# Altium schematic sheet Main.SchDoc: main
size 431 x 279 mm; VersionControl_RevNumber: 1.0; VersionControl_ProjFolderRevNumber: 1.0.0; ApprovedBy: ESE; CheckedBy: Justin, Bhagath; Author: Justin, bhagath; CompanyName: ESE Dept; DrawnBy: Justin, Bhagath; Engineer: Justin, Bhagath; Organization: ORGANIZATION; Address1: Electrical Engineering; Address2: 200 S 33rd St; Address3: Philadelphia; Address4: Pa 19104; DocumentNumber: 1; Revision: -; SheetNumber: 1; SheetTotal: 7; Project: ProtoWatch; ENG_APP_DATE: 02/12/21; DSN_APP_DATE: 02/12/21; CHK_APP_DATE: 02/12/21
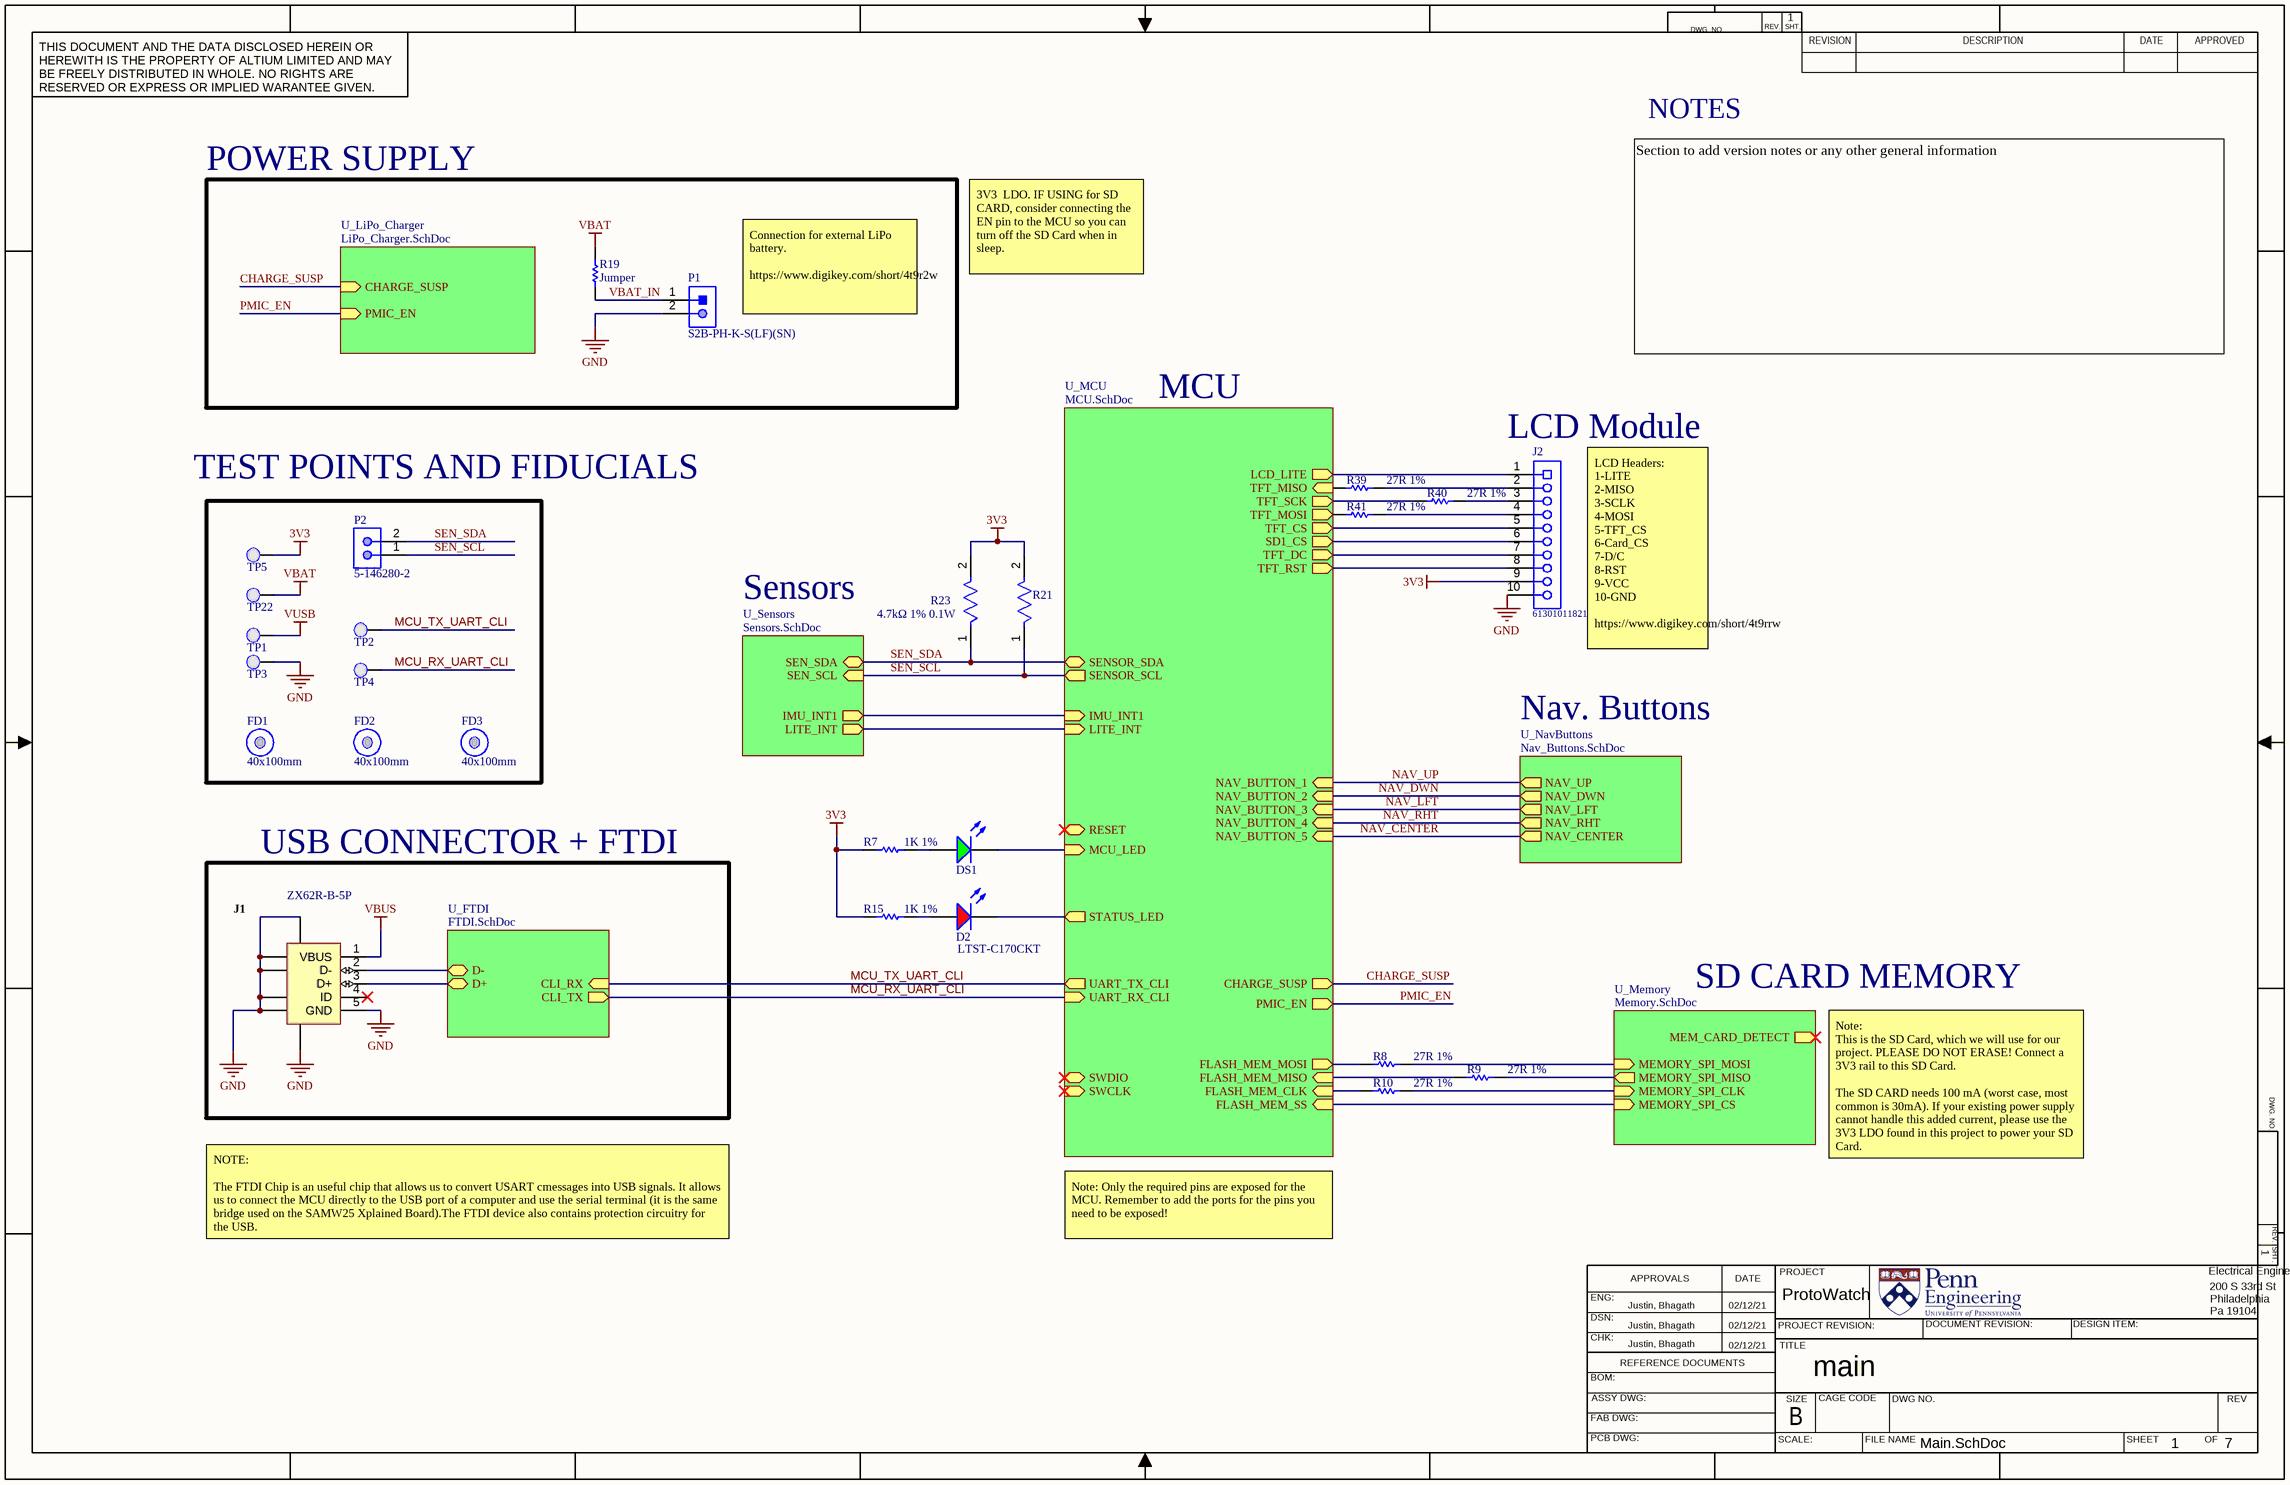
[diagram p0: Main.SchDoc]

## Parts
D2  LTST-C170CKT  [LTST-C170CKT_V]
DS1  LTST-C170GKT  [LTST-C170GKT_V]  (value not drawn)
FD1  40x100mm  [Fiducial_FT]  (no BOM)
FD2  40x100mm  [Fiducial_FT]  (no BOM)
FD3  40x100mm  [Fiducial_FT]  (no BOM)
J1  ZX62R-B-5P  [HIRO-ZX62R-B-5P_V]
J2  61301011821  [61301011821]
P1  S2B-PH-K-S(LF)(SN)  [JST-S2B-PH-K-S_V]
P2  5-146280-2  [TECO-5-146280-2_V]
R7  1K 1%  [RESC0603(1608)_N]
R8  27R 1%  [RESC0603(1608)_N]
R9  27R 1%  [RESC0603(1608)_N]
R10  27R 1%  [RESC0603(1608)_N]
R15  1K 1%  [RESC0603(1608)_N]
R19  Jumper  [RESC0603(1608)_N]
R21  4.7kΩ 1% 0.1W  [FP-RC1608-IPC_B]  (value not drawn)
R23  4.7kΩ 1% 0.1W  [FP-RC1608-IPC_B]
R39  27R 1%  [RESC0603(1608)_N]
R40  27R 1%  [RESC0603(1608)_N]
R41  27R 1%  [RESC0603(1608)_N]
TP1  0.1" Pad  [PCBComponent]  (value not drawn)  (no BOM)
TP2  0.1" Pad  [PCBComponent]  (value not drawn)  (no BOM)
TP3  0.1" Pad  [PCBComponent]  (value not drawn)  (no BOM)
TP4  0.1" Pad  [PCBComponent]  (value not drawn)  (no BOM)
TP5  0.1" Pad  [PCBComponent]  (value not drawn)  (no BOM)
TP22  0.1" Pad  [PCBComponent]  (value not drawn)  (no BOM)

## Blocks framed on the sheet
POWER SUPPLY: P1 R19
USB CONNECTOR + FTDI: J1

## Sub-sheets
U_FTDI = FTDI.SchDoc: CLI_RX (in), CLI_TX (out), D+ (bidir), D- (bidir)
U_LiPo_Charger = LiPo_Charger.SchDoc: CHARGE_SUSP (in), PMIC_EN (in)
U_MCU = MCU.SchDoc: SWDIO (bidir), SWCLK (in), UART_TX_CLI (out), UART_RX_CLI (in), FLASH_MEM_SS (in), FLASH_MEM_CLK (in), FLASH_MEM_MISO (in), FLASH_MEM_MOSI (out), RESET (bidir), MCU_LED (in), STATUS_LED (out), SD1_CS (out), LCD_LITE (out), TFT_DC (out), NAV_BUTTON_1 (in), SENSOR_SDA (bidir), TFT_SCK (out), TFT_CS (out), SENSOR_SCL (out), NAV_BUTTON_2 (in), NAV_BUTTON_3 (in), NAV_BUTTON_4 (in), NAV_BUTTON_5 (in), TFT_MOSI (out), TFT_RST (out), TFT_MISO (in), LITE_INT (in), IMU_INT1 (in), CHARGE_SUSP (out), PMIC_EN (out)
U_Memory = Memory.SchDoc: MEMORY_SPI_MOSI (in), MEMORY_SPI_MISO (out), MEMORY_SPI_CLK (in), MEMORY_SPI_CS (in), MEM_CARD_DETECT (out)
U_NavButtons = Nav_Buttons.SchDoc: NAV_RHT (out), NAV_DWN (out), NAV_LFT (out), NAV_CENTER (out), NAV_UP (out)
U_Sensors = Sensors.SchDoc: SEN_SCL (in), IMU_INT1 (out), LITE_INT (out), SEN_SDA (bidir)

## Nets
3V3: J2.9 R7.1 R15.1 R21.2 R23.2 TP5.1(PAD)
GND: J1.5(GND) J1.6(SHLD) J1.7(SHLD) J1.8(SHLD) J1.9(SHLD) J1.10(SHLD) J1.11(SHLD) J2.10 P1.2 TP3.1(PAD)
VBAT: R19.1 TP22.1(PAD)
VBUS: J1.1(VBUS)
VUSB: TP1.1(PAD)
CHARGE_SUSP: sheet U_MCU/CHARGE_SUSP, sheet U_LiPo_Charger/CHARGE_SUSP
MCU_RX_UART_CLI: TP4.1(PAD) ; sheet U_FTDI/CLI_TX, sheet U_MCU/UART_RX_CLI
MCU_TX_UART_CLI: TP2.1(PAD) ; sheet U_FTDI/CLI_RX, sheet U_MCU/UART_TX_CLI
NAV_CENTER: sheet U_MCU/NAV_BUTTON_5, sheet U_NavButtons/NAV_CENTER
NAV_DWN: sheet U_MCU/NAV_BUTTON_2, sheet U_NavButtons/NAV_DWN
NAV_LFT: sheet U_MCU/NAV_BUTTON_3, sheet U_NavButtons/NAV_LFT
NAV_RHT: sheet U_MCU/NAV_BUTTON_4, sheet U_NavButtons/NAV_RHT
NAV_UP: sheet U_MCU/NAV_BUTTON_1, sheet U_NavButtons/NAV_UP
PMIC_EN: sheet U_MCU/PMIC_EN, sheet U_LiPo_Charger/PMIC_EN
SEN_SCL: P2.1 R21.1 ; sheet U_MCU/SENSOR_SCL, sheet U_Sensors/SEN_SCL
SEN_SDA: P2.2 R23.1 ; sheet U_MCU/SENSOR_SDA, sheet U_Sensors/SEN_SDA
VBAT_IN: P1.1 R19.2
NetD2_1: D2.1(A) R15.2
NetD2_2: D2.2(K) ; sheet U_MCU/STATUS_LED
NetDS1_1: DS1.1(A) R7.2
NetDS1_2: DS1.2(K) ; sheet U_MCU/MCU_LED
NetJ1_2: J1.2(D-) ; sheet U_FTDI/D-
NetJ1_3: J1.3(D+) ; sheet U_FTDI/D+
NetJ2_1: J2.1 ; sheet U_MCU/LCD_LITE
NetJ2_2: J2.2 R39.2
NetJ2_3: J2.3 R40.2
NetJ2_4: J2.4 R41.2
NetJ2_5: J2.5 ; sheet U_MCU/TFT_CS
NetJ2_6: J2.6 ; sheet U_MCU/SD1_CS
NetJ2_7: J2.7 ; sheet U_MCU/TFT_DC
NetJ2_8: J2.8 ; sheet U_MCU/TFT_RST
NetR8_1: R8.1 ; sheet U_MCU/FLASH_MEM_MOSI
NetR8_2: R8.2 ; sheet U_Memory/MEMORY_SPI_MOSI
NetR9_1: R9.1 ; sheet U_MCU/FLASH_MEM_MISO
NetR9_2: R9.2 ; sheet U_Memory/MEMORY_SPI_MISO
NetR10_1: R10.1 ; sheet U_MCU/FLASH_MEM_CLK
NetR10_2: R10.2 ; sheet U_Memory/MEMORY_SPI_CLK
NetR39_1: R39.1 ; sheet U_MCU/TFT_MISO
NetR40_1: R40.1 ; sheet U_MCU/TFT_SCK
NetR41_1: R41.1 ; sheet U_MCU/TFT_MOSI
(unnamed): sheet U_MCU/FLASH_MEM_SS, sheet U_Memory/MEMORY_SPI_CS
(unnamed): sheet U_MCU/LITE_INT, sheet U_Sensors/LITE_INT
(unnamed): sheet U_MCU/IMU_INT1, sheet U_Sensors/IMU_INT1

Not connected (* = marked no-connect by the designer): J1 4(ID)*

## Notes on the sheet
- NOTES
- 3V3  LDO. IF USING for SD CARD, consider connecting the EN pin to the MCU so you can turn off the SD Card when in sleep.
- Connection for external LiPo battery.
  https://www.digikey.com/short/4t9r2w
- Section to add version notes or any other general information
- MCU
- TEST POINTS AND FIDUCIALS
- (near J2) LCD Module
- Sensors
- LCD Headers:
  1-LITE
  2-MISO
  3-SCLK
  4-MOSI
  5-TFT_CS
  6-Card_CS
  7-D/C
  8-RST
  9-VCC
  10-GND
  https://www.digikey.com/short/4t9rrw
- Nav. Buttons
- SD CARD MEMORY
- Note:
  This is the SD Card, which we will use for our project. PLEASE DO NOT ERASE! Connect a 3V3 rail to this SD Card.
  The SD CARD needs 100 mA (worst case, most common is 30mA). If your existing power supply cannot handle this added current, please use the 3V3 LDO found in this project to power your SD Card.
- NOTE:
  The FTDI Chip is an useful chip that allows us to convert USART cmessages into USB signals. It allows us to connect the MCU directly to the USB port of a computer and use the serial terminal (it is the same bridge used on the SAMW25 Xplained Board).The FTDI device also contains protection circuitry for the USB.
- Note: Only the required pins are exposed for the MCU. Remember to add the ports for the pins you need to be exposed!
- DWG. NO.
- REV.
- SHT.
- THIS DOCUMENT AND THE DATA DISCLOSED HEREIN OR HEREWITH IS THE PROPERTY OF ALTIUM LIMITED AND MAY BE FREELY DISTRIBUTED IN WHOLE. NO RIGHTS ARE RESERVED OR EXPRESS OR IMPLIED WARANTEE GIVEN.
- REVISION
- DESCRIPTION
- DATE
- APPROVED
- ENG:
- APPROVALS
- PROJECT
- DSN:
- CHK:
- REFERENCE DOCUMENTS
- PROJECT REVISION:
- TITLE
- DOCUMENT REVISION:
- DESIGN ITEM:
- BOM:
- FAB DWG:
- PCB DWG:
- ASSY DWG:
- SCALE:
- SIZE
- B
- CAGE CODE
- FILE NAME
- DWG NO.
- SHEET
- OF
- REV

## Library data of the parts
D2 = CMP-1674-00001-5: LED Uni-Color Red, 100 mW, 200 mA, -55 to 85 degC, 2-Pin SMD, RoHS, Tape and Reel; Manufacturer: Lite-On; PackageReference: C170CKT; ComponentLink1Description: Manufacturer URL; ComponentLink1URL: http://www.us.liteon.com/; Package Quantity: 3000; Packaging: Tape and Reel; Pins: 2; ComponentLink2URL: http://media.digikey.com/pdf/Data%20Sheets/Lite-On%20PDFs/LTST-C170CKT.pdf; Max Operating Temperature: 85 degC; Min Operating Temperature: -55 degC; Mounting Technology: Surface Mount; Mount: Surface Mount; Length: 2 mm; ComponentLink2Description: Datasheet; DatasheetVersion: 03/2003; Height: 1.1 mm; PackageDescription: 2-Pin Surface Mount Device, Body 2 x 1.25 mm; RoHSCompliant: true; Colour: Red
DS1 = CMP-1674-00002-5: LED Uni-Color Green, 100 mW, 120 mA, -55 to 85 degC, 2-Pin SMD, RoHS, Tape and Reel; Manufacturer: Lite-On; PackageReference: C170GKT; ComponentLink1Description: Manufacturer URL; ComponentLink1URL: http://www.us.liteon.com/; Height: 1.1 mm; PackageDescription: 2-Pin Surface Mount Device, Body 2 x 1.25 mm; RoHSCompliant: true; Package Quantity: 1; Packaging: Tape and Reel; Mount: Surface Mount; Min Operating Temperature: -55 degC; DatasheetVersion: 03/2003; Max Operating Temperature: 85 degC; Pins: 2; Mounting Technology: Surface Mount; Length: 2 mm; Colour: Green; ComponentLink2URL: http://media.digikey.com/pdf/Data%20Sheets/Lite-On%20PDFs/LTST-C170GKT.pdf; ComponentLink2Description: Datasheet
FD1-FD3 = CMP-00174-A.4: Fiducial 40x100mm
J1 = CMP-0031-00001-1: Connector; USBMicro-B,Reverse type, SMT; 5 Position; Right Angle; DatasheetVersion: 08/2010; Operating Temperature: -30 to 85 degC; Mounting Technology: Surface Mount; PartNumber: ZX62R-B-5P; PackageReference: ZX62R-B-5P; ComponentLink2URL: http://www.hirose.co.jp/cataloge_hp/e24200011.pdf; ComponentLink1URL: http://www.hirose.com/â€Ž; ComponentLink2Description: Datasheet; PackageDescription: 5-Pin USB Micro-B R/A Connector; ComponentLink1Description: Manufacturer URL
J2 = CMP-1502-01332-1: THT Vertical Socket Header WR-PHD, Pitch 2.54 mm, Single Row, 10 pins; Manufacturer: Wurth Elektronik; Rated Current: 3A; Working Voltage: 250VAC; Gender: Female; Pitch: 2.54mm; Contact Resistance: 20mOhm; Pin Number: 10; Withstanding Voltage: 500VAC; Publisher: WurthElektronik; Orientation: Vertical; Row Number: Single; Package Reference: 61301011821; Packaging: Tray; Datasheet URL: https://katalog.we-online.de/em/datasheet/6130xx11821.pdf; Operating Temperature: -40to125degC; Part Number: 61301011821; Manufacturer URL: http://www.we-online.de; Mounting Technology: THT
P1 = CMP-1755-00004-1: Male Header, Pitch 2 mm, 1 x 2 Position, Height 4.8 mm, Tail Length 3.4 mm, -25 to 85 degC, RoHS, Bulk; Case\Package: Radial; Tolerance: 20%; Capacitance: 10 uF; Voltage Rating (DC): 50 V; Packaging: Bulk; ComponentLink1URL: http://www.jst-mfg.com/product/pdf/eng/ePH.pdf; Radiation Hardening: No; Height: 11 mm; Package Quantity: 200; PackageDescription: Male Header, Pitch 2 mm, 1 x 2 Position, Height 4.8 mm, Tail Length 3.4 mm; PackageReference: S2B-PH-K-S; Diameter: 5 mm; Pins: 2; Mount: Through Hole; Max Operating Temperature: 85 degC; Min Operating Temperature: -40 degC; ComponentLink1Description: Datasheet; DatasheetVersion: Dec-12; Length: 11 mm; Lead Pitch: 2 mm; REACH SVHC: No SVHC; Voltage Rating: 50 V; RoHSCompliant: true
P2 = CMP-2000-07492-1: Male Header, Pitch 2.54 mm, 1 x 2 Position, Height 8.21 mm, Tail Length 3.05 mm, -65 to 105 degC, RoHS, Bulk; Manufacturer: TE Connectivity; Mating Connector Lock: No(Without); Number of Positions: 2; Pitch: 2.54mm; PCB Mounting Orientation: Vertical; Keyed: No; Case\/Package: 100; Mating Post Length: 0.23inch; High Temperature Housing: Yes; Max Current Rating: 5A; PCB Thickness: 0.063inch; PCB Mount Retention: Without; Approvals: CSA; Current Rating: 3A; Radiation Hardening: No; Length: 4.67mm; Contact Mating Length: 0.23inch; Connector Type: Header; Number of Rows: 1; Termination Post Length: 0.12inch; Board Standoff: No(Without); Max Operating Temperature: 105degC; Contact Shape: Square; Selectively Loaded: No(Without); Gasket: No(Without); Number of Contacts: 2; Contact Gender: Male; Mating Alignment: No(Without); Manufacturer URL: http://www.te.com/; Datasheet URL: http://www.te.com/commerce/DocumentDelivery/DDEController?Action=showdoc&DocId=Customer+Drawing%7F146280%7FH1%7Fpdf%7FEnglish%7FENG_CD_146280_H1.pdf%7F5-146280-2; Mount: ThroughHole; Orientation: Straight; Packaging: Carton; Package Reference: 5-146280-2; Package Quantity: 500; Stabilizers: No(Without); Row Spacing: 2.54mm; Contact Material: CopperAlloy; Panel Mount Retention: No(Without); Datasheet Version: Rev. H1, 08/2016; Housing Colour: Black; Colour: Black; Package Description: Male Header, Pitch 2.54 mm, 1 x 2 Position, Height 8.21 mm, Tail Length 3.05 mm; Contact Plating: Matte; Housing Material: Polymer; Contact Protection: No(Without); Min Operating Temperature: -65degC; Mounting Technology: ThroughHole; Flammability Rating: UL94V-0; RoHSCompliant: true; Termination: ThroughHole; Depth: 2.34mm; High Speed Serial Data Connector: No
R7 R15 = CMP-1012-00510-1: 1K 0.1W 1% 0603 (1608 Metric)  SMD; Case-Metric: 1608; Case-EIA: 0603; Value: 1000.00 Ohm; Technology: SMT; Tolerance: 1 %; Power: 0.1 W
R8-R10 R39-R41 = CMP-1012-00331-1: 27R 0.1W 1% 0603 (1608 Metric)  SMD; Case-EIA: 0603; Value: 27.00 Ohm; Case-Metric: 1608; Technology: SMT; Tolerance: 1 %; Power: 0.1 W
R19 = CMP-1012-00001-1: Jumper 0603 (1608 Metric); Case-Metric: 1608; Value: 0.00 Ohm; Power: None; Case-EIA: 0603; Technology: SMT; Tolerance: None
R21 R23 = CMP-13261-001964-1: Res Thick Film 0603 4.7kΩ 1% 0.1W ±100ppm/°C Molded SMD T/R RC1608F472AS; Resistance: 4.7kR; Voltage Rating (DC): 50V; Max Operating Temperature: 155°C; Composition: Thick Film; Lead Free: Lead Free; Case/Package: 0603; Min Operating Temperature: -55°C; Temperature Coefficient: 100ppm/°C; Tolerance: 1%; Contact Plating: Tin
TP1-TP5 TP22 = 0.1" Pad-A.4